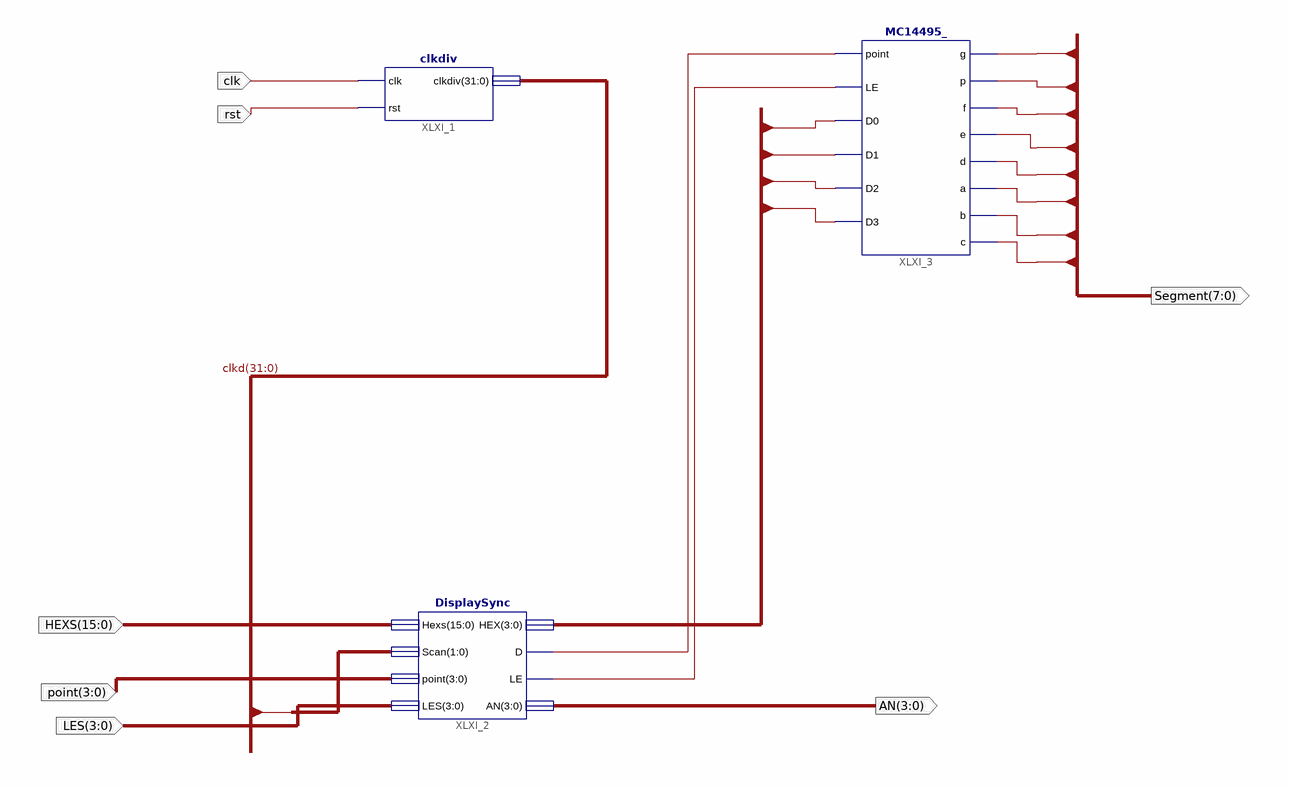
[diagram p0: schematic sheet 1]
// Xilinx ISE schematic disp_num.sch (kintex7) as structural Verilog: 3 symbols, 7 ports
module disp_num (
  input  clk,
  input  rst,
  input  [15:0] HEXS,
  input  [3:0] point,
  input  [3:0] LES,
  output [3:0] AN,
  output [7:0] Segment
);

  wire XLXN_16, XLXN_18;
  wire [3:0] HEX;
  wire [31:0] clkd;

  clkdiv XLXI_1 (.clk(clk), .rst(rst), .clkdiv(clkd));
  DisplaySync XLXI_2 (
    .Hexs(HEXS), .Scan(clkd[18:17]), .point(point), .LES(LES), .HEX(HEX), .D(XLXN_18), .LE(XLXN_16), .AN(AN));
  MC14495_ XLXI_3 (
    .point(XLXN_18), .LE(XLXN_16), .D0(HEX[0]), .D1(HEX[1]), .D2(HEX[2]), .D3(HEX[3]), .g(Segment[6]),
    .p(Segment[7]), .f(Segment[5]), .e(Segment[4]), .d(Segment[3]), .a(Segment[0]), .b(Segment[1]),
    .c(Segment[2]));
endmodule
